# EasyEDA schematic SCH_PicoPU_MoBo_2025-06-30.json
TITLE: Sheet_1; REV: 1.0; Date: 2025-02-02; Sheet: 1/1; Drawn By: C2Coder; Company: Your Company
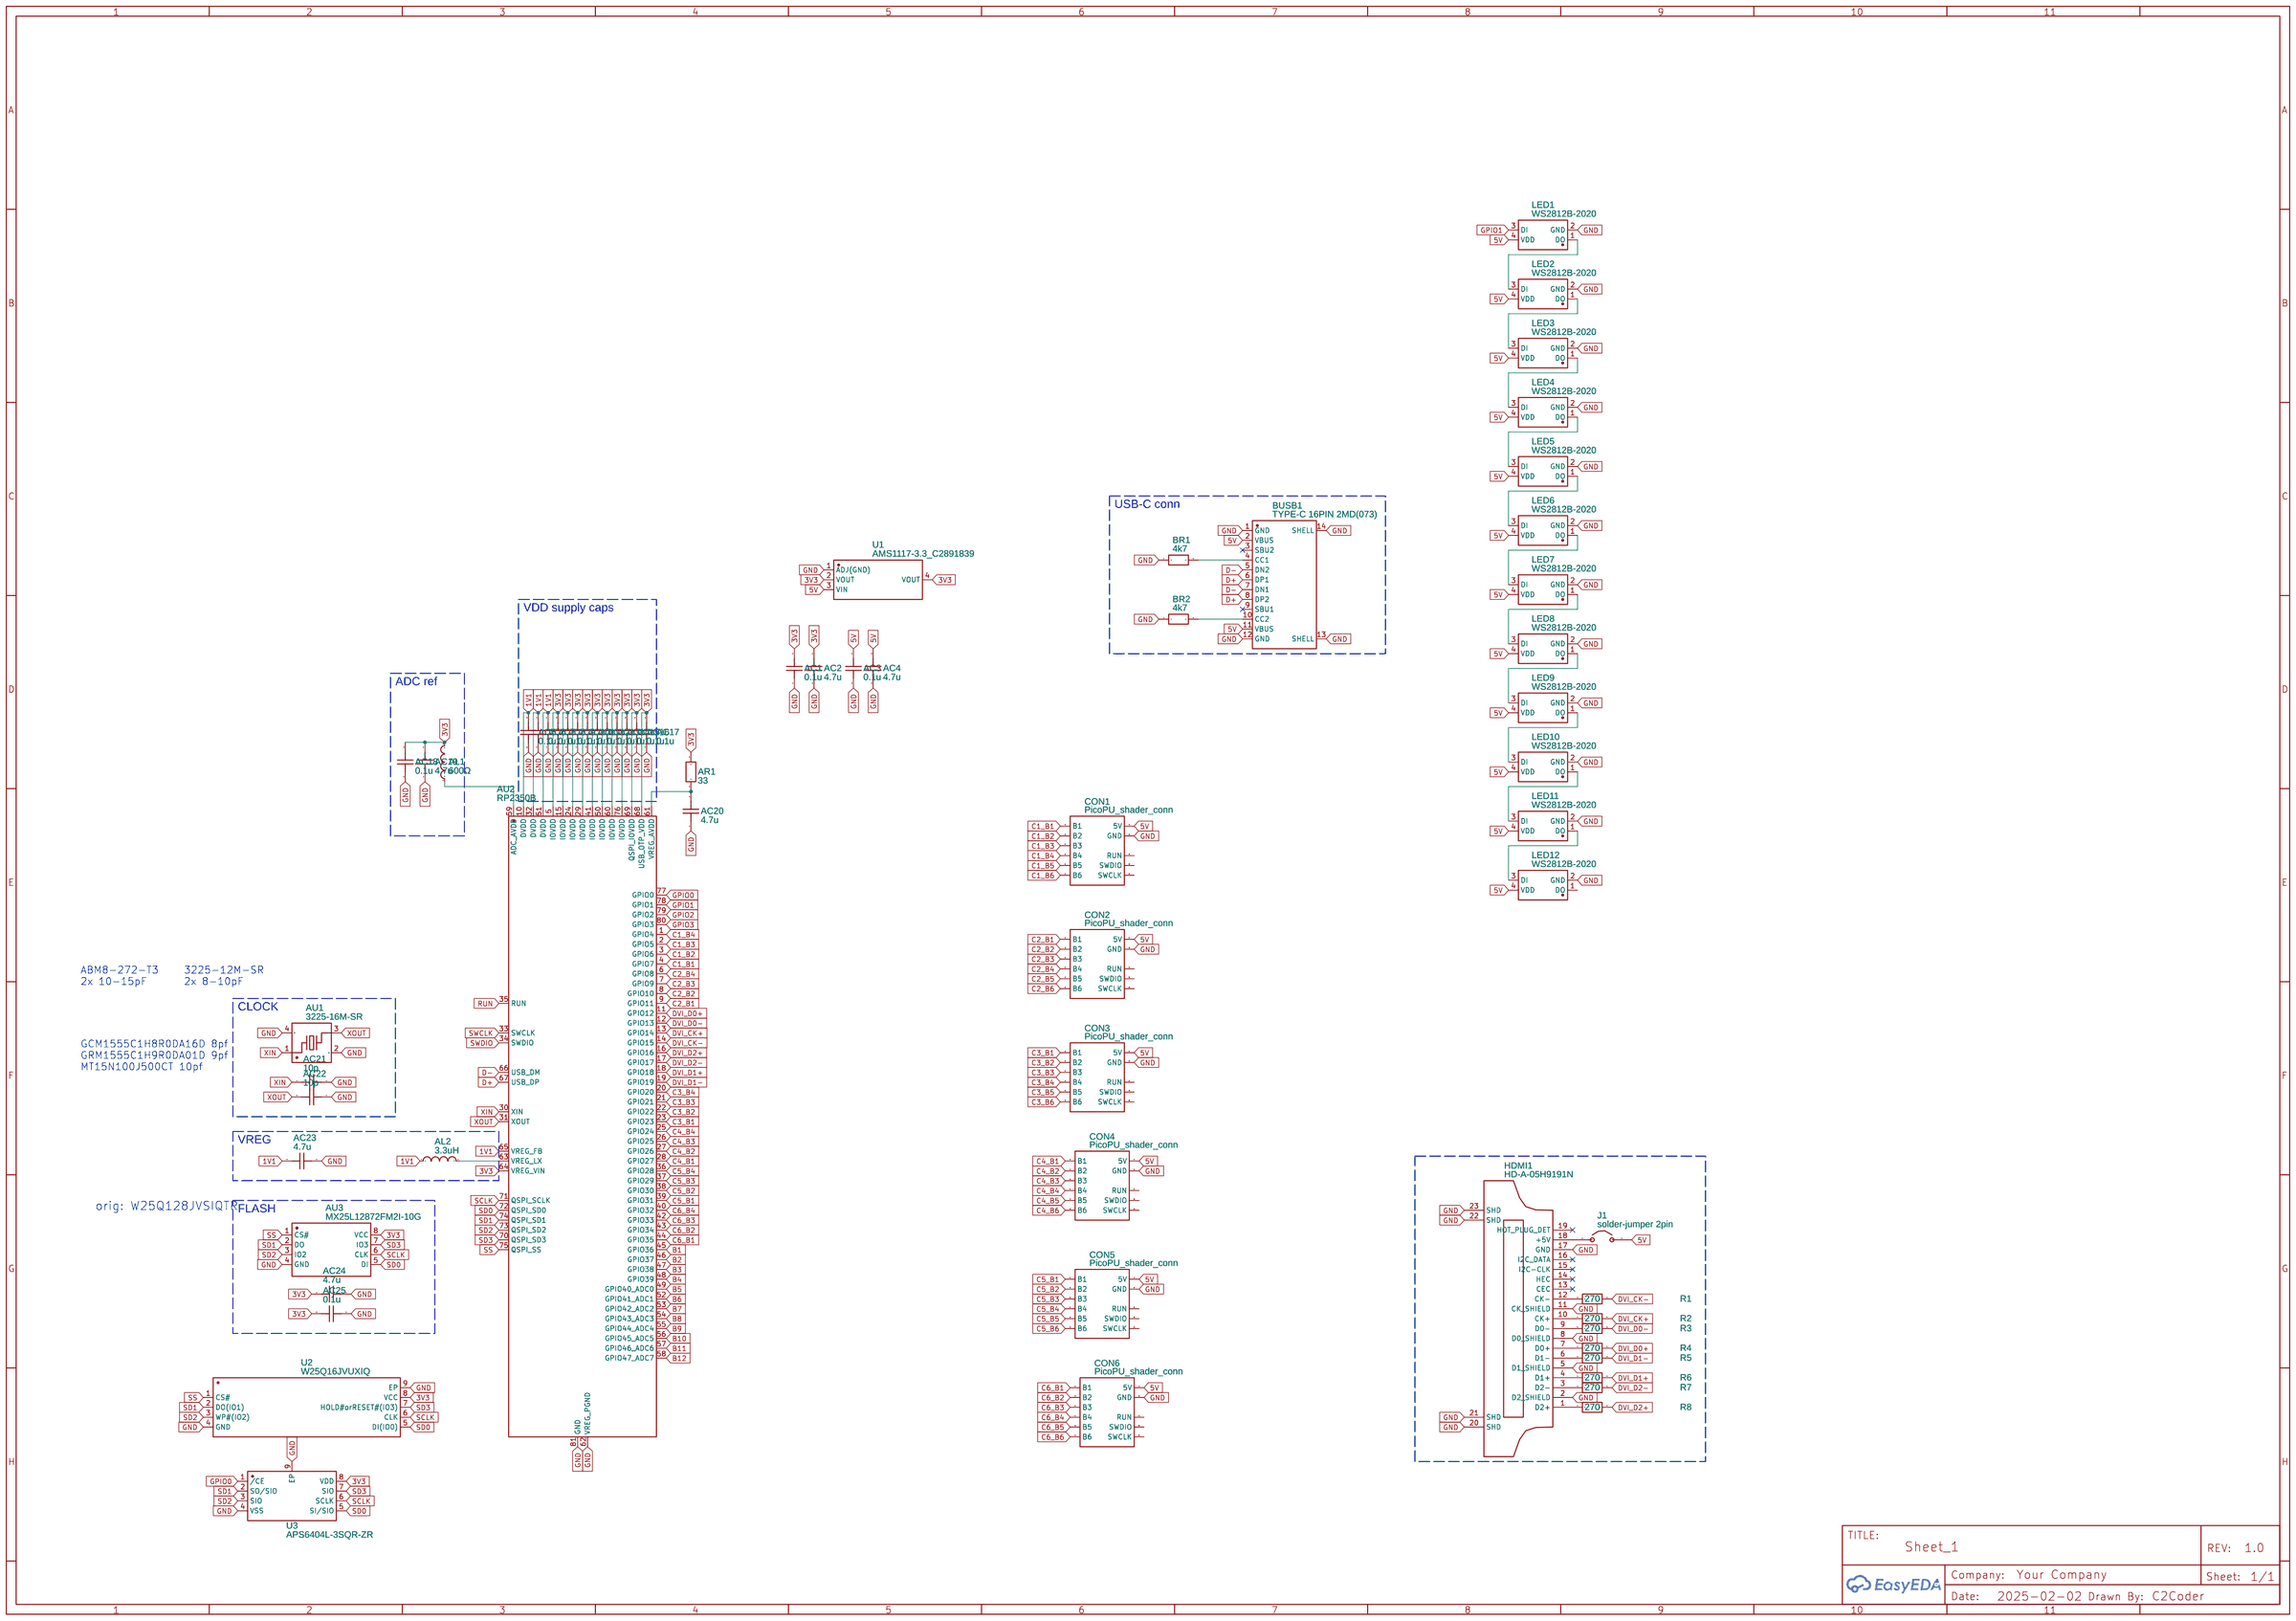
[diagram p0: schematic sheet]

## Parts
AC1  0.1u  [C0402]
AC2  4.7u  [C0603]
AC3  0.1u  [C0402]
AC4  4.7u  [C0603]
AC5  0.1u  [C0402]
AC6  0.1u  [C0402]
AC7  0.1u  [C0402]
AC8  0.1u  [C0402]
AC9  0.1u  [C0402]
AC10  0.1u  [C0402]
AC11  0.1u  [C0402]
AC12  0.1u  [C0402]
AC13  0.1u  [C0402]
AC14  0.1u  [C0402]
AC15  0.1u  [C0402]
AC16  0.1u  [C0402]
AC17  0.1u  [C0402]
AC18  0.1u  [C0402]
AC19  4.7u  [C0603]
AC20  4.7u  [C0603]
AC21  10p  [C0402]
AC22  10p  [C0402]
AC23  4.7u  [C0603]
AC24  4.7u  [C0603]
AC25  0.1u  [C0402]
AL1  600Ω  [L0603]
AL2  3.3uH  [L1008]
AR1  33  [R0402]
AU1  3225-16M-SR  [CRYSTAL-SMD_4P-L3.2-W2.5-BL]
AU2  RP2350B  [QFN-80_L10.0-W10.0-P0.40-TL-EP3.4]
AU3  MX25L12872FM2I-10G  [SOIC-8_L5.3-W5.3-P1.27-LS8.0-BL]
BR1  4k7  [R0402]
BR2  4k7  [R0402]
BUSB1  TYPE-C 16PIN 2MD(073)  [USB-C-SMD_TYPE-C-16PIN-USB4215]
CON1  PicoPU_shader_conn  [PICOPU_SHADER_CONN]
CON2  PicoPU_shader_conn  [PICOPU_SHADER_CONN]
CON3  PicoPU_shader_conn  [PICOPU_SHADER_CONN]
CON4  PicoPU_shader_conn  [PICOPU_SHADER_CONN]
CON5  PicoPU_shader_conn  [PICOPU_SHADER_CONN]
CON6  PicoPU_shader_conn  [PICOPU_SHADER_CONN]
HDMI1  HD-A-05H9191N  [HDMI-SMD_HD-A-05H9192N]
J1  solder-jumper 2pin  [SOLDER-JUMPER]
LED1  WS2812B-2020  [LED-SMD_4P-L2.0-W2.0-TL_WS2812B-2020]
LED2  WS2812B-2020  [LED-SMD_4P-L2.0-W2.0-TL_WS2812B-2020]
LED3  WS2812B-2020  [LED-SMD_4P-L2.0-W2.0-TL_WS2812B-2020]
LED4  WS2812B-2020  [LED-SMD_4P-L2.0-W2.0-TL_WS2812B-2020]
LED5  WS2812B-2020  [LED-SMD_4P-L2.0-W2.0-TL_WS2812B-2020]
LED6  WS2812B-2020  [LED-SMD_4P-L2.0-W2.0-TL_WS2812B-2020]
LED7  WS2812B-2020  [LED-SMD_4P-L2.0-W2.0-TL_WS2812B-2020]
LED8  WS2812B-2020  [LED-SMD_4P-L2.0-W2.0-TL_WS2812B-2020]
LED9  WS2812B-2020  [LED-SMD_4P-L2.0-W2.0-TL_WS2812B-2020]
LED10  WS2812B-2020  [LED-SMD_4P-L2.0-W2.0-TL_WS2812B-2020]
LED11  WS2812B-2020  [LED-SMD_4P-L2.0-W2.0-TL_WS2812B-2020]
LED12  WS2812B-2020  [LED-SMD_4P-L2.0-W2.0-TL_WS2812B-2020]
R1  270  [R0402]
R2  270  [R0402]
R3  270  [R0402]
R4  270  [R0402]
R5  270  [R0402]
R6  270  [R0402]
R7  270  [R0402]
R8  270  [R0402]
U1  AMS1117-3.3_C2891839  [SOT-223-3_L6.5-W3.4-P2.30-LS7.0-BR]
U2  W25Q16JVUXIQ  [USON-8_L3.0-W2.0-P0.50-BL-EP]
U3  APS6404L-3SQR-ZR  [USON-8_L3.0-W2.0-P0.50-BL-EP]

## Library data of the parts
AC1 AC3 AC5-AC18 AC25 = C_0402_US: Supplier Part: CL05B104KP5NNNC; Supplier: Tme; Contributor: LCEDA_Lib; Manufacturer Part: CL05B104KP5NNNC; Manufacturer: SAMSUNG; Have: Yes
AC2 AC4 AC19 AC20 AC23 AC24 = C_0402_US: Supplier Part: 0603X475K100CT; Supplier: Tme; Contributor: LCEDA_Lib; Manufacturer Part: 0603X475K100CT; Manufacturer: WALSIN; Have: Yes
AC21 AC22 = C_0402_US: Supplier Part: MT15N100J500CT; Supplier: Tme; Contributor: LCEDA_Lib; Manufacturer Part: MT15N100J500CT; Manufacturer: WALSIN; Have: Yes
AL1 = BLM18HE601SN1D: Supplier: Tme; Manufacturer: muRata; Have: Yes
AL2 = AOTA-B201610S3R3-101-T: Contributor: Nephrite; Supplier: Tme; Supplier Part: LQM2HPN3R3MG0L; Manufacturer: MURATA; Manufacturer Part: LQM2HPN3R3MG0L; Have: Yes
AR1 = R_0402_EU: Supplier Part: HP02-33R1%; Supplier: Tme; Contributor: LCEDA_Lib; Manufacturer Part: HP02WAF330JTCE; Manufacturer: ROYALOHM
AU1 = 3225-16M-SR: Supplier: Tme; Supplier Part: 3225-12M-SR; Manufacturer: SR Passives; Contributor: lcsc; Have: Yes
AU2 = RP2350B: Supplier: LCSC; Supplier Part: C9900136713; Manufacturer: null; Contributor: lcsc
AU3 = W25Q128JVSIQTR: Supplier: Tme; Manufacturer: RENESAS; Manufacturer Part: AT25SF081B-SSHD-T; Supplier Part: AT25SF081B-SSHD-T
BR1 BR2 = R_0402_EU: Supplier Part: HP02-33R1%; Supplier: Tme; Contributor: LCEDA_Lib; Manufacturer Part: HP02WAF4701TCE; Manufacturer: ROYALOHM; Have: Yes
BUSB1 = TYPE-C 16PIN 2MD(073): Contributor: LCSC; Supplier: Tme; Supplier Part: USB4215-03-A; Manufacturer: GCT; Manufacturer Part: USB4215-03-A; Have: Yes
CON1-CON6 = PicoPU_shader_conn: Contributor: jansky.stepan08
HDMI1 = HD-A-05H9191N: Supplier: LCSC; Supplier Part: C18213861; Manufacturer: HanElectricity(瀚源); Contributor: lcsc; JLCPCB Part Class: Extended Part; Have: Yes
J1 = solder-jumper 2pin: Contributor: KidCe
LED1-LED12 = WS2812B-2020: Contributor: LCSC; Supplier: LCSC; Supplier Part: C965555; Manufacturer: worldsemi; JLCPCB Part Class: Extended Part; Have: Yes
R1-R8 = R_0402_EU: Contributor: LCEDA_Lib; Have: Yes
U1 = AMS1117-3.3_C2891839: Contributor: LCSC; Supplier: LCSC; Supplier Part: C2891839; Manufacturer: YONGYUTAI(永裕泰); Manufacturer Part: AMS1117-3.3; JLCPCB Part Class: Extended Part; link: https://lcsc.com/eda_search?q=C2891839&%26type=1&ref=editor; Have: Yes
U2 = W25Q16JVUXIQ: Contributor: lcsc; Supplier: LCSC; Supplier Part: C2843335; Manufacturer: WINBOND(华邦); JLCPCB Part Class: Extended Part
U3 = APS6404L-3SQR-ZR: Contributor: lcsc; Supplier: LCSC; Supplier Part: C3040877; Manufacturer: Apmemory; JLCPCB Part Class: Extended Part

## Nets
1V1: AC5.2 AC6.2 AC7.2 AC23.2 AL2.1 AU2.10(DVDD) AU2.32(DVDD) AU2.51(DVDD) AU2.65(VREG_FB)
3V3: AC1.2 AC2.2 AC8.2 AC9.2 AC10.2 AC11.2 AC12.2 AC13.2 AC14.2 AC15.2 AC16.2 AC17.2 AC18.2 AC19.2 AC24.2 AC25.2 AL1.2 AR1.2 AU2.5(IOVDD) AU2.15(IOVDD) AU2.24(IOVDD) AU2.29(IOVDD) AU2.41(IOVDD) AU2.50(IOVDD) AU2.60(IOVDD) AU2.64(VREG_VIN) AU2.68(USB_OTP_VDD) AU2.69(QSPI_IOVDD) AU2.76(IOVDD) AU3.8(VCC) U1.2(VOUT) U1.4(VOUT) U2.8(VCC) U3.8(VDD)
5V: AC3.2 AC4.2 BUSB1.2(VBUS) BUSB1.11(VBUS) CON1.5V CON2.5V CON3.5V CON4.5V CON5.5V CON6.5V J1.2 LED1.4(VDD) LED2.4(VDD) LED3.4(VDD) LED4.4(VDD) LED5.4(VDD) LED6.4(VDD) LED7.4(VDD) LED8.4(VDD) LED9.4(VDD) LED10.4(VDD) LED11.4(VDD) LED12.4(VDD) U1.3(VIN)
GND: AC1.1 AC2.1 AC3.1 AC4.1 AC5.1 AC6.1 AC7.1 AC8.1 AC9.1 AC10.1 AC11.1 AC12.1 AC13.1 AC14.1 AC15.1 AC16.1 AC17.1 AC18.1 AC19.1 AC20.1 AC21.1 AC22.1 AC23.1 AC24.1 AC25.1 AU1.2(GND) AU1.4(GND) AU2.62(VREG_PGND) AU2.81(GND) AU3.4(GND) BR1.1 BR2.1 BUSB1.1(GND) BUSB1.12(GND) BUSB1.13(SHELL) BUSB1.14(SHELL) CON1.GND CON2.GND CON3.GND CON4.GND CON5.GND CON6.GND HDMI1.2(D2_SHIELD) HDMI1.5(D1_SHIELD) HDMI1.8(D0_SHIELD) HDMI1.11(CK_SHIELD) HDMI1.17(GND) HDMI1.20(SHD) HDMI1.21(SHD) HDMI1.22(SHD) HDMI1.23(SHD) LED1.2(GND) LED2.2(GND) LED3.2(GND) LED4.2(GND) LED5.2(GND) LED6.2(GND) LED7.2(GND) LED8.2(GND) LED9.2(GND) LED10.2(GND) LED11.2(GND) LED12.2(GND) U1.1(ADJ(GND)) U2.4(GND) U2.9(EP) U3.4(VSS) U3.9(EP)
B1: AU2.45(GPIO36)
B2: AU2.46(GPIO37)
B3: AU2.47(GPIO38)
B4: AU2.48(GPIO39)
B5: AU2.49(GPIO40_ADC0)
B6: AU2.52(GPIO41_ADC1)
B7: AU2.53(GPIO42_ADC2)
B8: AU2.54(GPIO43_ADC3)
B9: AU2.55(GPIO44_ADC4)
B10: AU2.56(GPIO45_ADC5)
B11: AU2.57(GPIO46_ADC6)
B12: AU2.58(GPIO47_ADC7)
C1_B1: AU2.4(GPIO7) CON1.B1
C1_B2: AU2.3(GPIO6) CON1.B2
C1_B3: AU2.2(GPIO5) CON1.B3
C1_B4: AU2.1(GPIO4) CON1.B4
C1_B5: CON1.B5
C1_B6: CON1.B6
C2_B1: AU2.9(GPIO11) CON2.B1
C2_B2: AU2.8(GPIO10) CON2.B2
C2_B3: AU2.7(GPIO9) CON2.B3
C2_B4: AU2.6(GPIO8) CON2.B4
C2_B5: CON2.B5
C2_B6: CON2.B6
C3_B1: AU2.23(GPIO23) CON3.B1
C3_B2: AU2.22(GPIO22) CON3.B2
C3_B3: AU2.21(GPIO21) CON3.B3
C3_B4: AU2.20(GPIO20) CON3.B4
C3_B5: CON3.B5
C3_B6: CON3.B6
C4_B1: AU2.28(GPIO27) CON4.B1
C4_B2: AU2.27(GPIO26) CON4.B2
C4_B3: AU2.26(GPIO25) CON4.B3
C4_B4: AU2.25(GPIO24) CON4.B4
C4_B5: CON4.B5
C4_B6: CON4.B6
C5_B1: AU2.39(GPIO31) CON5.B1
C5_B2: AU2.38(GPIO30) CON5.B2
C5_B3: AU2.37(GPIO29) CON5.B3
C5_B4: AU2.36(GPIO28) CON5.B4
C5_B5: CON5.B5
C5_B6: CON5.B6
C6_B1: AU2.44(GPIO35) CON6.B1
C6_B2: AU2.43(GPIO34) CON6.B2
C6_B3: AU2.42(GPIO33) CON6.B3
C6_B4: AU2.40(GPIO32) CON6.B4
C6_B5: CON6.B5
C6_B6: CON6.B6
D+: AU2.67(USB_DP) BUSB1.6(DP1) BUSB1.8(DP2)
D-: AU2.66(USB_DM) BUSB1.5(DN2) BUSB1.7(DN1)
DVI_CK+: AU2.13(GPIO14) R2.2
DVI_CK-: AU2.14(GPIO15) R1.2
DVI_D0+: AU2.11(GPIO12) R4.2
DVI_D0-: AU2.12(GPIO13) R3.2
DVI_D1+: AU2.18(GPIO18) R6.2
DVI_D1-: AU2.19(GPIO19) R5.2
DVI_D2+: AU2.16(GPIO16) R8.2
DVI_D2-: AU2.17(GPIO17) R7.2
GPIO0: AU2.77(GPIO0) U3.1(/CE)
GPIO1: AU2.78(GPIO1) LED1.3(DI)
GPIO2: AU2.79(GPIO2)
GPIO3: AU2.80(GPIO3)
RUN: AU2.35(RUN)
SCLK: AU2.71(QSPI_SCLK) AU3.6(CLK) U2.6(CLK) U3.6(SCLK)
SD0: AU2.72(QSPI_SD0) AU3.5(DI) U2.5(DI(IO0)) U3.5(SI/SIO)
SD1: AU2.74(QSPI_SD1) AU3.2(DO) U2.2(DO(IO1)) U3.2(SO/SIO)
SD2: AU2.73(QSPI_SD2) AU3.3(IO2) U2.3(WP#(IO2)) U3.3(SIO)
SD3: AU2.70(QSPI_SD3) AU3.7(IO3) U2.7(HOLD#orRESET#(IO3)) U3.7(SIO)
SS: AU2.75(QSPI_SS) AU3.1(CS#) U2.1(CS#)
SWCLK: AU2.33(SWCLK)
SWDIO: AU2.34(SWDIO)
XIN: AC21.2 AU1.1 AU2.30(XIN)
XOUT: AC22.2 AU1.3 AU2.31(XOUT)
Net-(AC20-2): AC20.2 AR1.1 AU2.61(VREG_AVDD)
Net-(AL1-1): AL1.1 AU2.59(ADC_AVDD)
Net-(AL2-2): AL2.2 AU2.63(VREG_LX)
Net-(BR1-2): BR1.2 BUSB1.4(CC1)
Net-(BR2-2): BR2.2 BUSB1.10(CC2)
Net-(HDMI1-1): HDMI1.1(D2+) R8.1
Net-(HDMI1-3): HDMI1.3(D2-) R7.1
Net-(HDMI1-4): HDMI1.4(D1+) R6.1
Net-(HDMI1-6): HDMI1.6(D1-) R5.1
Net-(HDMI1-7): HDMI1.7(D0+) R4.1
Net-(HDMI1-9): HDMI1.9(D0-) R3.1
Net-(HDMI1-10): HDMI1.10(CK+) R2.1
Net-(HDMI1-12): HDMI1.12(CK-) R1.1
Net-(HDMI1-18): HDMI1.18(+5V) J1.1
Net-(LED1-1): LED1.1(DO) LED2.3(DI)
Net-(LED2-1): LED2.1(DO) LED3.3(DI)
Net-(LED3-1): LED3.1(DO) LED4.3(DI)
Net-(LED4-1): LED4.1(DO) LED5.3(DI)
Net-(LED5-1): LED5.1(DO) LED6.3(DI)
Net-(LED6-1): LED6.1(DO) LED7.3(DI)
Net-(LED7-1): LED7.1(DO) LED8.3(DI)
Net-(LED8-1): LED8.1(DO) LED9.3(DI)
Net-(LED9-1): LED9.1(DO) LED10.3(DI)
Net-(LED10-1): LED10.1(DO) LED11.3(DI)
Net-(LED11-1): LED11.1(DO) LED12.3(DI)

Not connected (* = marked no-connect by the designer): BUSB1 3(SBU2)* 9(SBU1)*; CON1 RUN SWCLK SWDIO; CON2 RUN SWCLK SWDIO; CON3 RUN SWCLK SWDIO; CON4 RUN SWCLK SWDIO; CON5 RUN SWCLK SWDIO; CON6 RUN SWCLK SWDIO; HDMI1 13(CEC)* 14(HEC)* 15(I2C-CLK)* 16(I2C_DATA)* 19(HOT_PLUG_DET)*; LED12 1(DO)

## Notes on the sheet
- USB-C conn
- VDD supply caps
- ADC ref
- ABM8-272-T3
  2x 10-15pF
- 3225-12M-SR
  2x 8-10pF
- CLOCK
- GCM1555C1H8R0DA16D 8pf
  GRM1555C1H9R0DA01D 9pf
  MT15N100J500CT 10pf
- VREG
- orig: W25Q128JVSIQTR
- FLASH
